# EasyEDA Pro project SCH.epro

# Schematic 15B_SCH
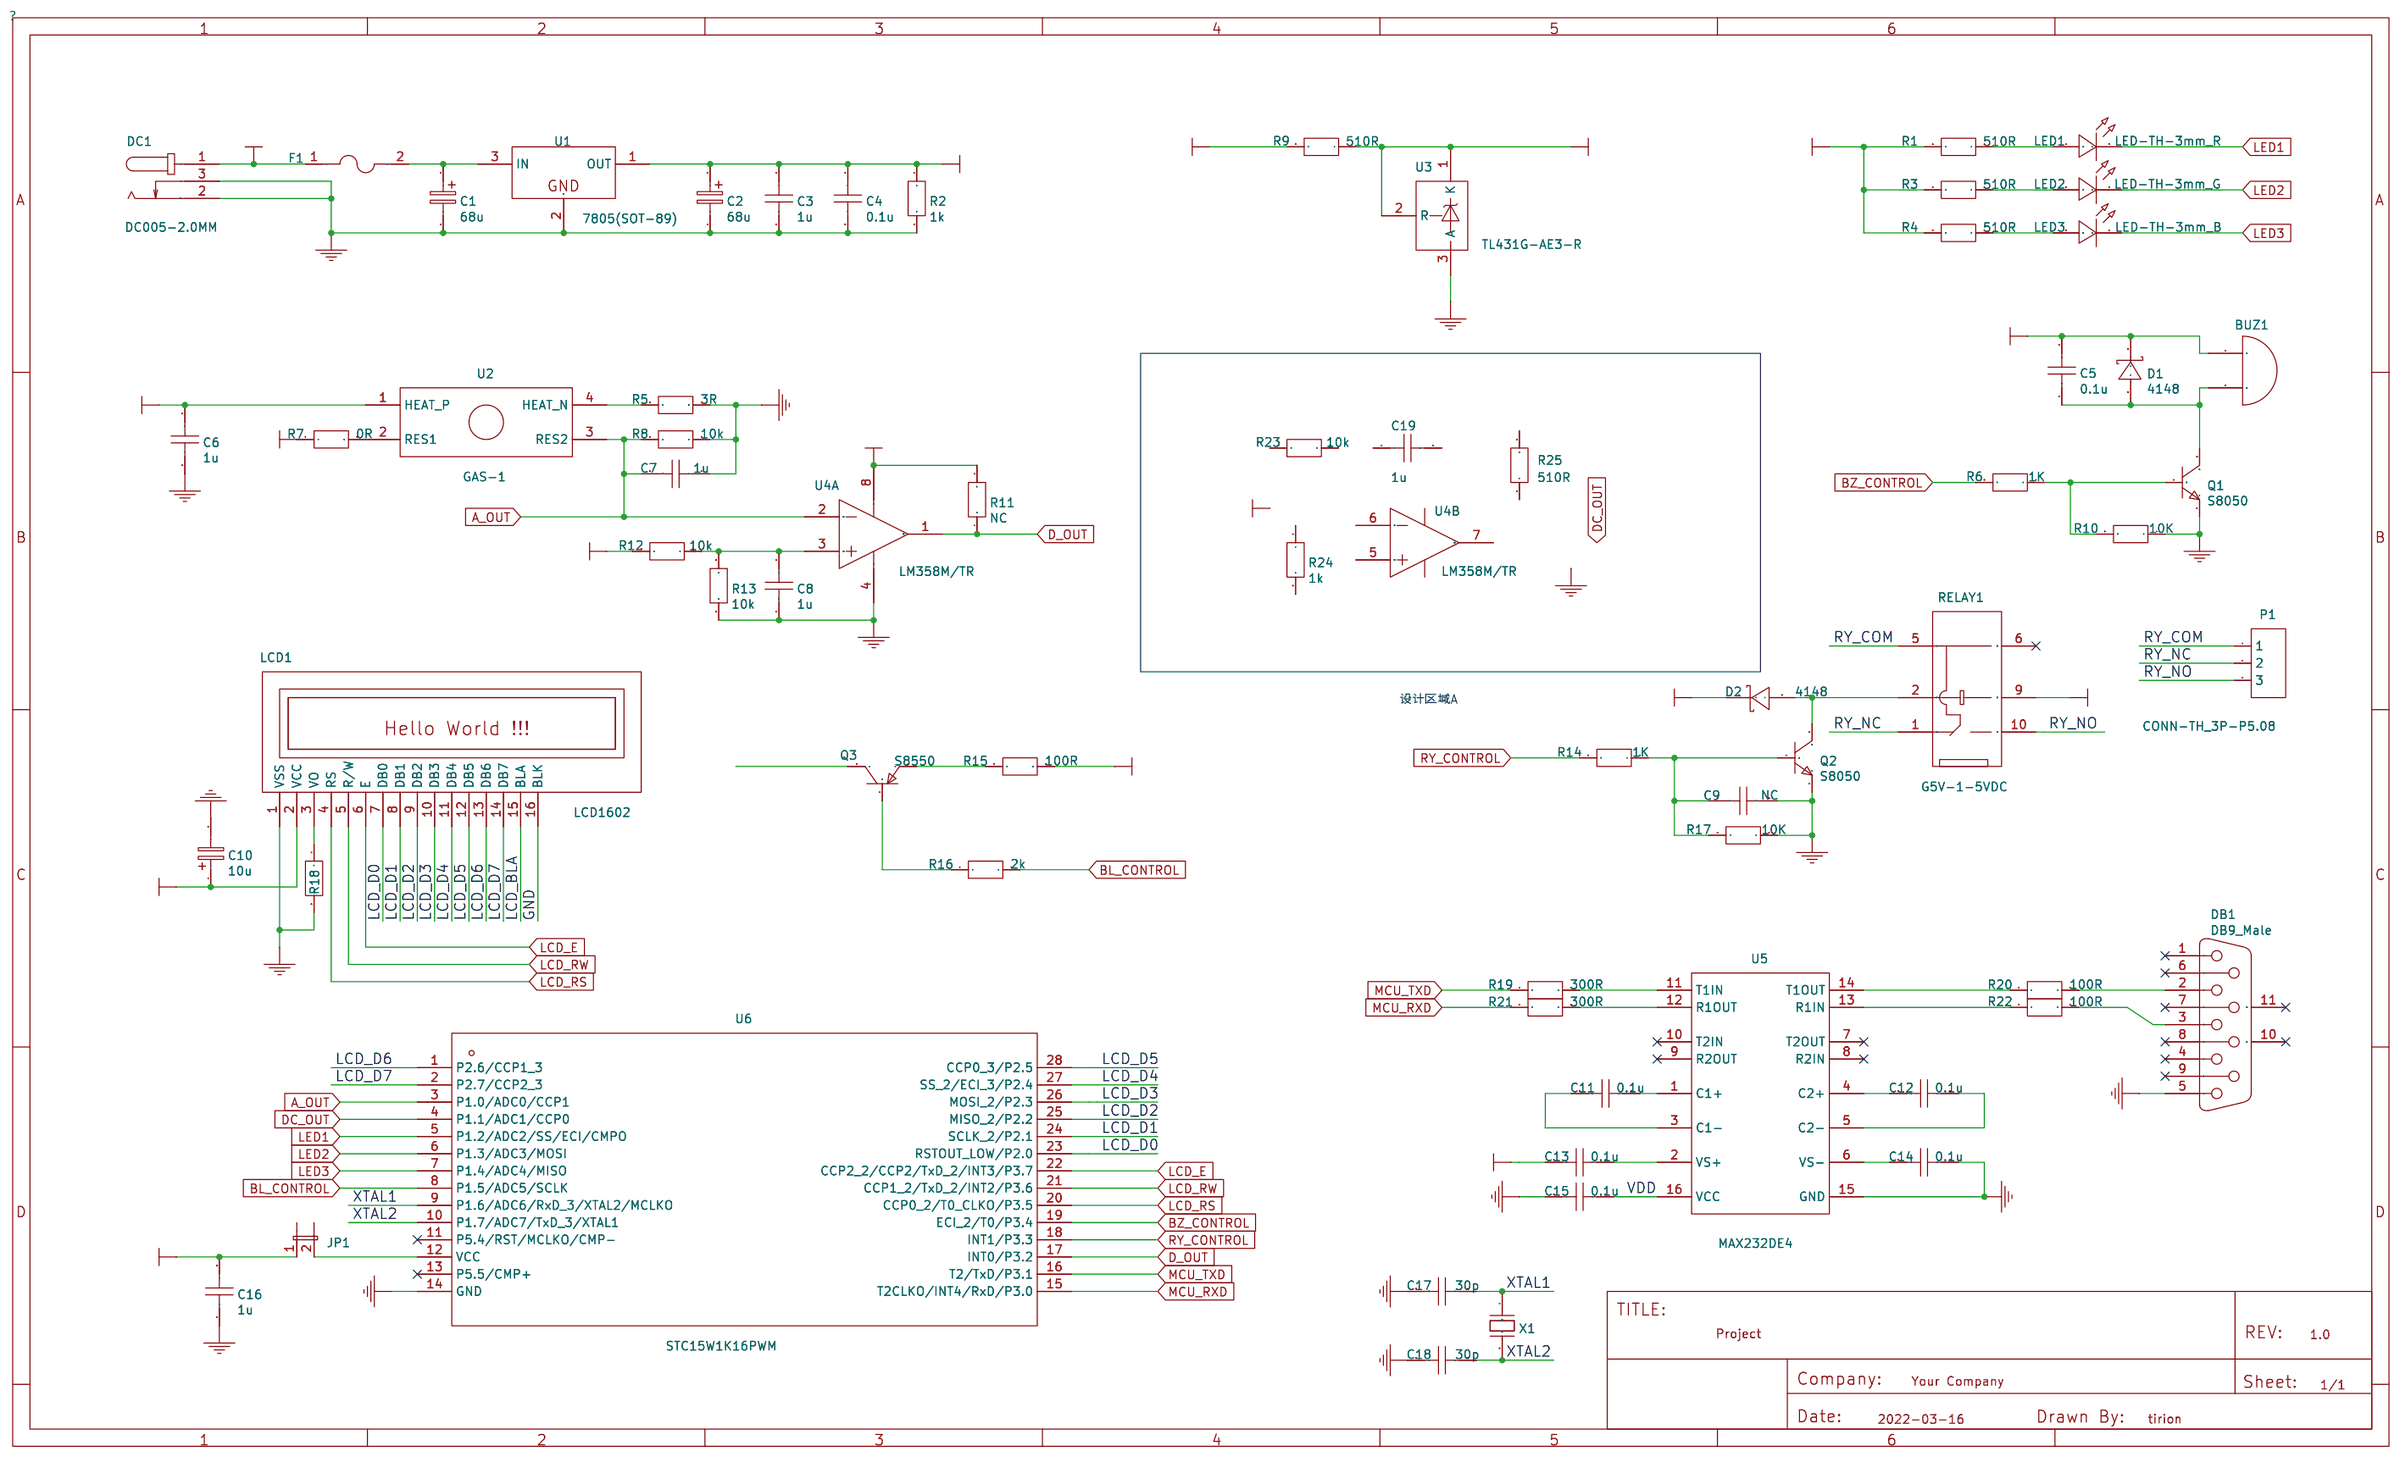
[diagram p0: schematic sheet]

## Parts
BUZ1  BUZ1
C1  68u
C2  68u
C3  1u
C4  0.1u
C5  0.1u
C6  1u
C7  1u
C8  1u
C9  NC
C10  10u
C11  0.1u
C12  0.1u
C13  0.1u
C14  0.1u
C15  0.1u
C16  1u
C17  30p
C18  30p
C19  1u
D1  4148
D2  4148
DB1  DB9_Male
DC1  DC005-2.0MM
F1  FUSE_F1812_FUSE
JP1  JUMPER2
LCD1  LCD1602
LED1  LED-TH-3mm_R
LED2  LED-TH-3mm_G
LED3  LED-TH-3mm_B
P1  CONN-TH_3P-P5.08
Q1  S8050
Q2  S8050
Q3  S8550
R1  510R
R2  1k
R3  510R
R4  510R
R5  3R
R6  1K
R7  0R
R8  10k
R9  510R
R10  10K
R11  NC
R12  10k
R13  10k
R14  1K
R15  100R
R16  2k
R17  10K
R18  10k
R19  300R
R20  100R
R21  300R
R22  100R
R23  10k
R24  1k
R25  510R
RELAY1  G5V-1-5VDC
U1  7805(SOT-89)
U2  GAS-1
U3  TL431G-AE3-R
U4  LM358M/TR  (sections 1,2)
U5  MAX232DE4
U6  STC15W1K16PWM
X1  12MHZ

## Library data of the parts
BUZ1 = BUZ1
C1 C2 = 68u
C3 C6-C8 C16 C19 = 1u
C4 C5 C11-C15 = 0.1u
C9 R11 = NC
C10 = 10u
C17 C18 = 30p
D1 D2 = SS14: Supplier: LCSC; Manufacturer: MDD; Supplier Part: C2480; JLCPCB Part Class: Basic Part
DB1 = DB9_Male: Supplier Part: C185657; Supplier: LCSC; Manufacturer: Amphenol
DC1 = DC005-2.0MM: Supplier: LCSC; Manufacturer: SOFNG; Supplier Part: C111567
F1 = FUSE_F1812_FUSE: Supplier: LCSC; Supplier Part: C9900007509; JLCPCB Part Class: Extended Part
JP1 = JUMPER2: Jumper 2 Pin
LCD1 = LCM1602K-NSW-BBW: Manufacturer: LONTECH(厦门龙特); Supplier Part: C83275; Supplier: LCSC
LED1 = 204-10SDRD/S530-A3-L: Manufacturer: EVERLIGHT(台湾亿光); Supplier Part: C84774; Supplier: LCSC
LED2 = 204-10SYGD/S530-E3: Manufacturer: EVERLIGHT(台湾亿光); Supplier Part: C85161
LED3 = 204-10SUBC/S400-A4: Manufacturer: EVERLIGHT(台湾亿光); Supplier Part: C86881; Supplier: LCSC
P1 = CONN-TH_3P-P5.08: Supplier: LCSC
Q1 Q2 = S8050: Supplier: LCSC; Supplier Part: C916390; Manufacturer: JSMSEMI; JLCPCB Part Class: Extended Part
Q3 = S8550-H: Supplier: LCSC; Supplier Part: C699225; Manufacturer: Yangzhou Yangjie Elec Tech; JLCPCB Part Class: Extended Part
R1 R3 R4 R9 R25 = 510R
R2 R24 = 1k
R5 = 3R
R6 R14 = 1K
R7 = 0R
R8 R12 R13 R18 R23 = 10k
R10 R17 = 10K
R15 R20 R22 = 100R
R16 = 2k
R19 R21 = 300R
RELAY1 = G5V-1-5VDC: Supplier: LCSC; Manufacturer: OMRON; Supplier Part: C28695; JLCPCB Part Class: Extended Part
U1 = CJ78L05: Supplier: LCSC; Manufacturer: CJ; image: //image.lceda.cn/szlcsc/C2079.jpg; Supplier Part: C2079; Paste Type: expand
U2 = GAS-1
U3 = TL431G-AE3-R: Supplier: LCSC; Manufacturer: UTC; Supplier Part: C71130; JLCPCB Part Class: Extended Part
U4 = LM358M/TR: Supplier: LCSC; Supplier Part: C398078; Manufacturer: HGSEMI
U5 = MAX232DE4: Dual EIA-232 Driver  Receiver, 0 to 70 degC, 16-Pin SOIC (D), Green (RoHS  no SbBr)
U6 = STC15W1K16PWM: Supplier: LCSC; Manufacturer: STC; Supplier Part: C65670; JLCPCB Part Class: Extended Part
X1 = X49UD12MSD2SC: Supplier Part: undefined; Supplier: LCSC; Manufacturer: LCSC

## Nets
GND: C1.2 C2.2 C3.2 C4.2 C6.1 C7.1 C8.2 C9.2 C10.2 C14.2 C15.1 C16.1 C17.2 C18.2 DB1.5 DC1.2 DC1.3 LCD1.1(VSS) LCD1.16(BLK) Q1.2(E) Q2.2(E) R2.2 R5.2 R8.2 R10.1 R13.2 R17.1 R18.2 U1.2(GND) U3.3(A) U4.4(GND) U5.15(GND) U6.14(GND)
VDD: BUZ1.1(A) C2.1 C3.1 C4.1 C5.2 C6.2 C10.1 C13.1 C15.2 C16.2 D1.1(K) D2.1(K) JP1.1 LCD1.2(VCC) R1.2 R2.1 R3.2 R4.2 R9.2 R11.2 R15.2 RELAY1.9 U1.1(OUT) U2.1(HEAT_P) U4.8(VCC) U5.16(VCC)
A_OUT: C7.2 R8.1 U2.3(RES2) U4.2(1IN-) U6.3(P1.0/ADC0/CCP1)
BL_CONTROL: R16.2 U6.8(P1.5/ADC5/SCLK)
BZ_CONTROL: R6.2 U6.19(ECI_2/T0/P3.4)
D_OUT: R11.1 U4.1(1OUT) U6.17(INT0/P3.2)
DC_IN: DC1.1 F1.1
DC_OUT: U6.4(P1.1/ADC1/CCP0)
LCD_BLA: LCD1.15(BLA)
LCD_D0: LCD1.7(DB0) U6.23(RSTOUT_LOW/P2.0)
LCD_D1: LCD1.8(DB1) U6.24(SCLK_2/P2.1)
LCD_D2: LCD1.9(DB2) U6.25(MISO_2/P2.2)
LCD_D3: LCD1.10(DB3) U6.26(MOSI_2/P2.3)
LCD_D4: LCD1.11(DB4) U6.27(SS_2/ECI_3/P2.4)
LCD_D5: LCD1.12(DB5) U6.28(CCP0_3/P2.5)
LCD_D6: LCD1.13(DB6) U6.1(P2.6/CCP1_3)
LCD_D7: LCD1.14(DB7) U6.2(P2.7/CCP2_3)
LCD_E: LCD1.6(E) U6.22(CCP2_2/CCP2/TxD_2/INT3/P3.7)
LCD_RS: LCD1.4(RS) U6.20(CCP0_2/T0_CLKO/P3.5)
LCD_RW: LCD1.5(R/W) U6.21(CCP1_2/TxD_2/INT2/P3.6)
LED1: LED1.2 U6.5(P1.2/ADC2/SS/ECI/CMPO)
LED2: LED2.2 U6.6(P1.3/ADC3/MOSI)
LED3: LED3.2 U6.7(P1.4/ADC4/MISO)
MCU_RXD: R21.1 U6.15(T2CLKO/INT4/RxD/P3.0)
MCU_TXD: R19.1 U6.16(T2/TxD/P3.1)
RY_COM: P1.1 RELAY1.5
RY_CONTROL: R14.2 U6.18(INT1/P3.3)
RY_NC: P1.2 RELAY1.1
RY_NO: P1.3 RELAY1.10
VREF: R7.1 R9.1 R12.2 U3.1(K) U3.2(R)
XTAL1: C17.1 U6.9(P1.6/ADC6/RxD_3/XTAL2/MCLKO) X1.1(OSC1)
XTAL2: C18.1 U6.10(P1.7/ADC7/TxD_3/XTAL1) X1.2(OSC2)
Net-(BUZ1-2): BUZ1.2(B) C5.1 D1.2(A) Q1.3(C)
Net-(C1-1): C1.1 F1.2 U1.3(IN)
Net-(C8-1): C8.1 R12.1 R13.1 U4.3(1IN+)
Net-(C9-1): C9.1 Q2.1(B) R14.1 R17.2
Net-(C11-1): C11.1 U5.3(C1-)
Net-(C11-2): C11.2 U5.1(C1+)
Net-(C12-1): C12.1 U5.4(C2+)
Net-(C12-2): C12.2 U5.5(C2-)
Net-(C13-2): C13.2 U5.2(VS+)
Net-(C14-1): C14.1 U5.6(VS-)
Net-(D2-2): D2.2(A) Q2.3(C) RELAY1.2
Net-(DB1-2): DB1.2 R20.2
Net-(DB1-3): DB1.3 R22.2
Net-(JP1-2): JP1.2 U6.12(VCC)
Net-(LCD1-3): LCD1.3(VO) R18.1
Net-(LED1-1): LED1.1 R1.1
Net-(LED2-1): LED2.1 R3.1
Net-(LED3-1): LED3.1 R4.1
Net-(Q1-1): Q1.1(B) R6.1 R10.2
Net-(Q3-1): Q3.1(B) R16.1
Net-(Q3-2): Q3.2(E) R15.1
Net-(R5-1): R5.1 U2.4(HEAT_N)
Net-(R7-2): R7.2 U2.2(RES1)
Net-(R19-2): R19.2 U5.11(T1IN)
Net-(R20-1): R20.1 U5.14(T1OUT)
Net-(R21-2): R21.2 U5.12(R1OUT)
Net-(R22-1): R22.1 U5.13(R1IN)

Not connected (* = marked no-connect by the designer): C19 1 2; DB1 1* 4* 6* 7* 8* 9* 10(MH1)* 11(MH2)*; Q3 3(C); R23 1 2; R24 1 2; R25 1 2; RELAY1 6*; U4 5(2IN+) 6(2IN-) 7(2OUT); U5 7(T2OUT)* 8(R2IN)* 9(R2OUT)* 10(T2IN)*; U6 11(P5.4/RST/MCLKO/CMP-)* 13(P5.5/CMP+)*

## Notes on the sheet
- 设计区域A
